# EAGLE design 12V10A supply (EAGLE 6.4)
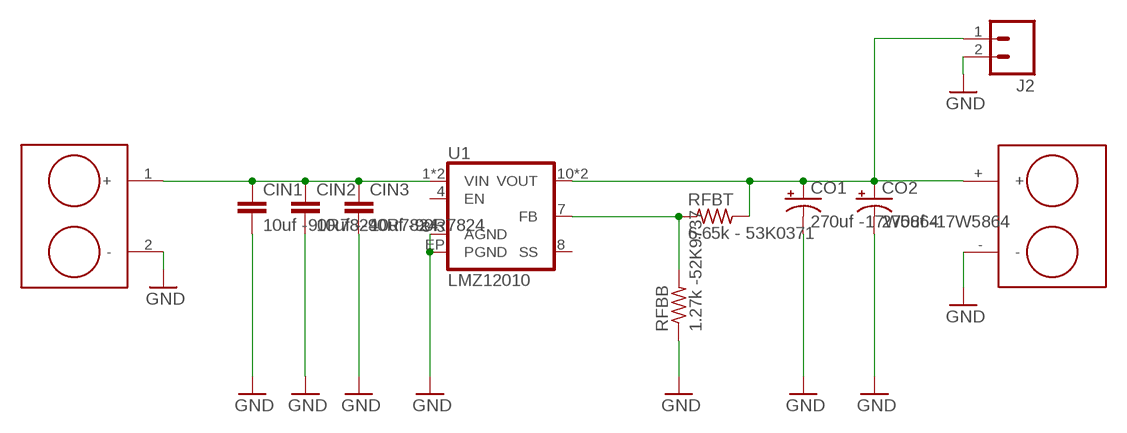
[diagram p0: schematic, sheet 1]

## Parts
CIN1  10uf -90R7824  C-EUC1210  [C1210]
CIN2  10uf --90R7824  C-EUC1210  [C1210]
CIN3  10uf -90R7824  C-EUC1210  [C1210]
CO1  270uf -17W5864  NPCAP-PXA-CAP  [JC0CAP]
CO2  270uf -17W5864  NPCAP-PXA-CAP  [JC0CAP]
J1  5569-02A2MS-225  [0050362375]
J2  M02PTH  [1X02]
J3  MC24356  [2PINTERMINAL]
RFBB  1.27k -52K9737  R-US_M0805  [M0805]
RFBT  6.65k - 53K0371  R-US_M0805  [M0805]
U1  LMZ12010  [TO-PMOD-11]

## Nets
GND: CIN1.2 CIN2.2 CIN3.2 CO1.- CO2.- J1.2(-) J2.2 J3.- RFBB.1 U1.3(AGND) U1.5(AGND) U1.6(AGND) U1.EP(PGND)
N$4: RFBB.2 RFBT.1 U1.7(FB)
VIN: CIN1.1 CIN2.1 CIN3.1 J1.1(+) U1.1(VIN) U1.2(VIN)
VOUT: CO1.+ CO2.+ J2.1 J3.+ RFBT.2 U1.10(VOUT) U1.11(VOUT)
Unconnected: U1.4(EN) U1.8(SS)

## Library data of the parts
CIN1-CIN3 = rcl:C-EU: CAPACITOR, European symbol
CO1 CO2 = Texas Instruments:NPCAP-PXA-CAP; MFG_PN: APXA160ARA331MJC0G; MOUSER_PN: 661-PXA16VC331M
J1 = Texas Instruments:5569
J2 = SparkFun-Connectors:M02: Header 2 Standard 2-pin 0.1" header. Use with straight break away headers (SKU : PRT-00116), right angle break away headers (PRT-00553), swiss pins (PRT-00743), machine pins (PRT-00117), and female headers (PRT-00115). Molex polarized connector foot print use with SKU : PRT-08233 with associated crimp pins and housings.
J3 = Texas Instruments:MC24356: MULTICOMP - MC24356 - TERMINAL BLOCK EUROSTYLE, 2POS, 26-12AWG
RFBB RFBT = adafruit:R-US_: RESISTOR, American symbol
U1 = Texas Instruments:LMZ12010: 3A, Simple Switcher Power Module with 42V Maximum Input

## Net classes
0 default: width 0.305 mm

## Board
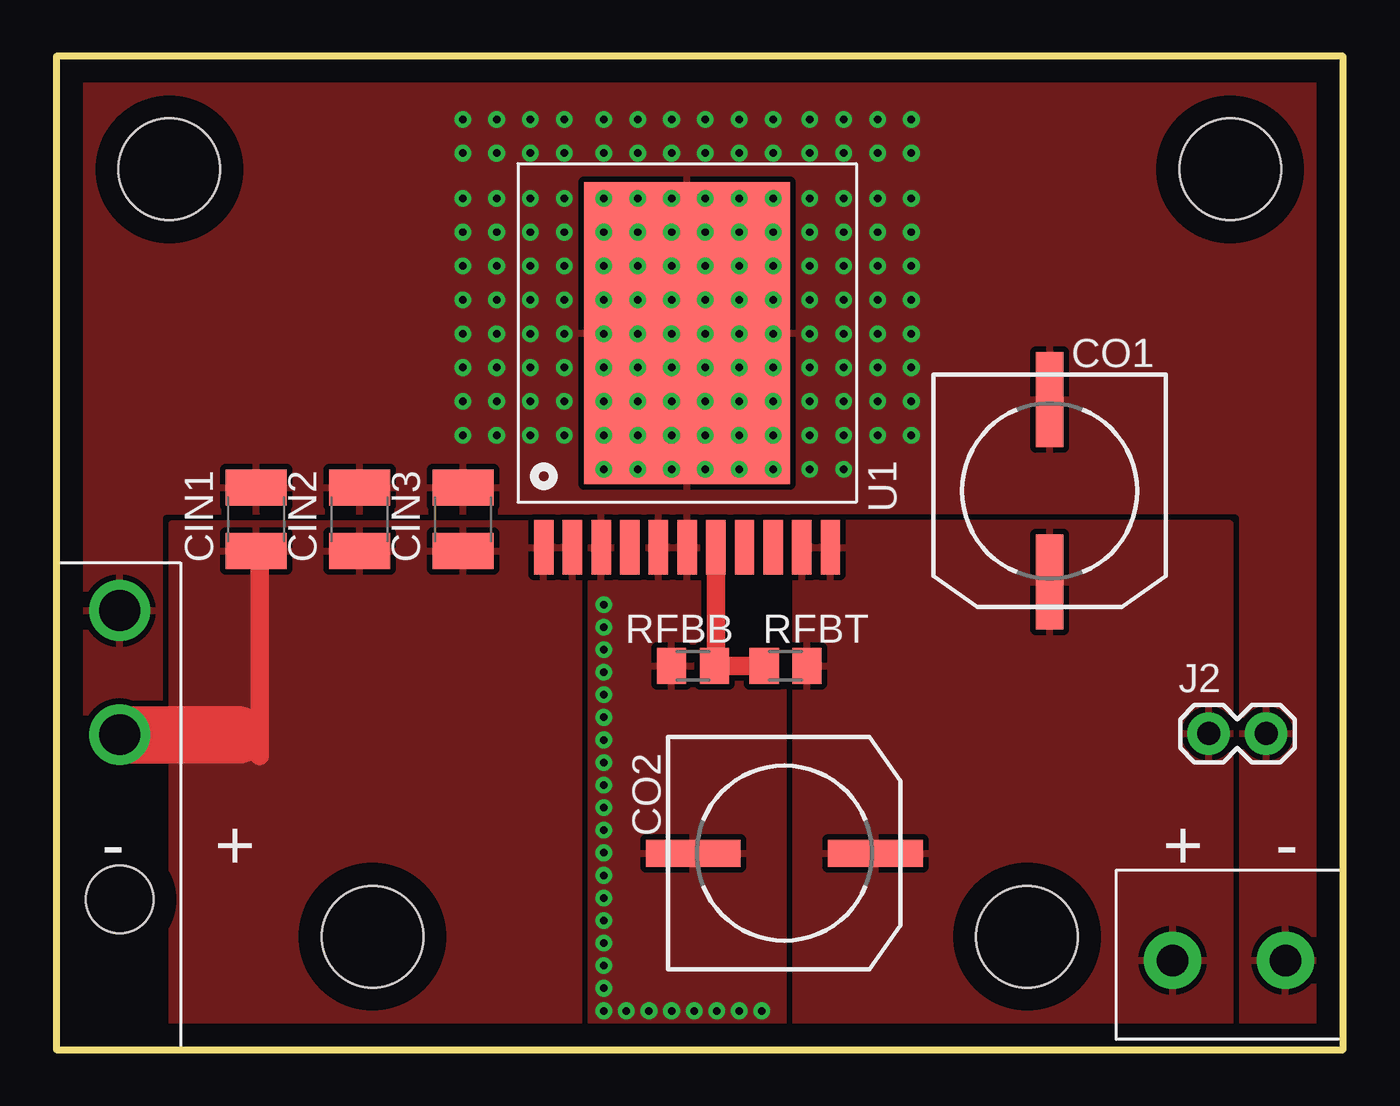
[diagram p1: board, top side]
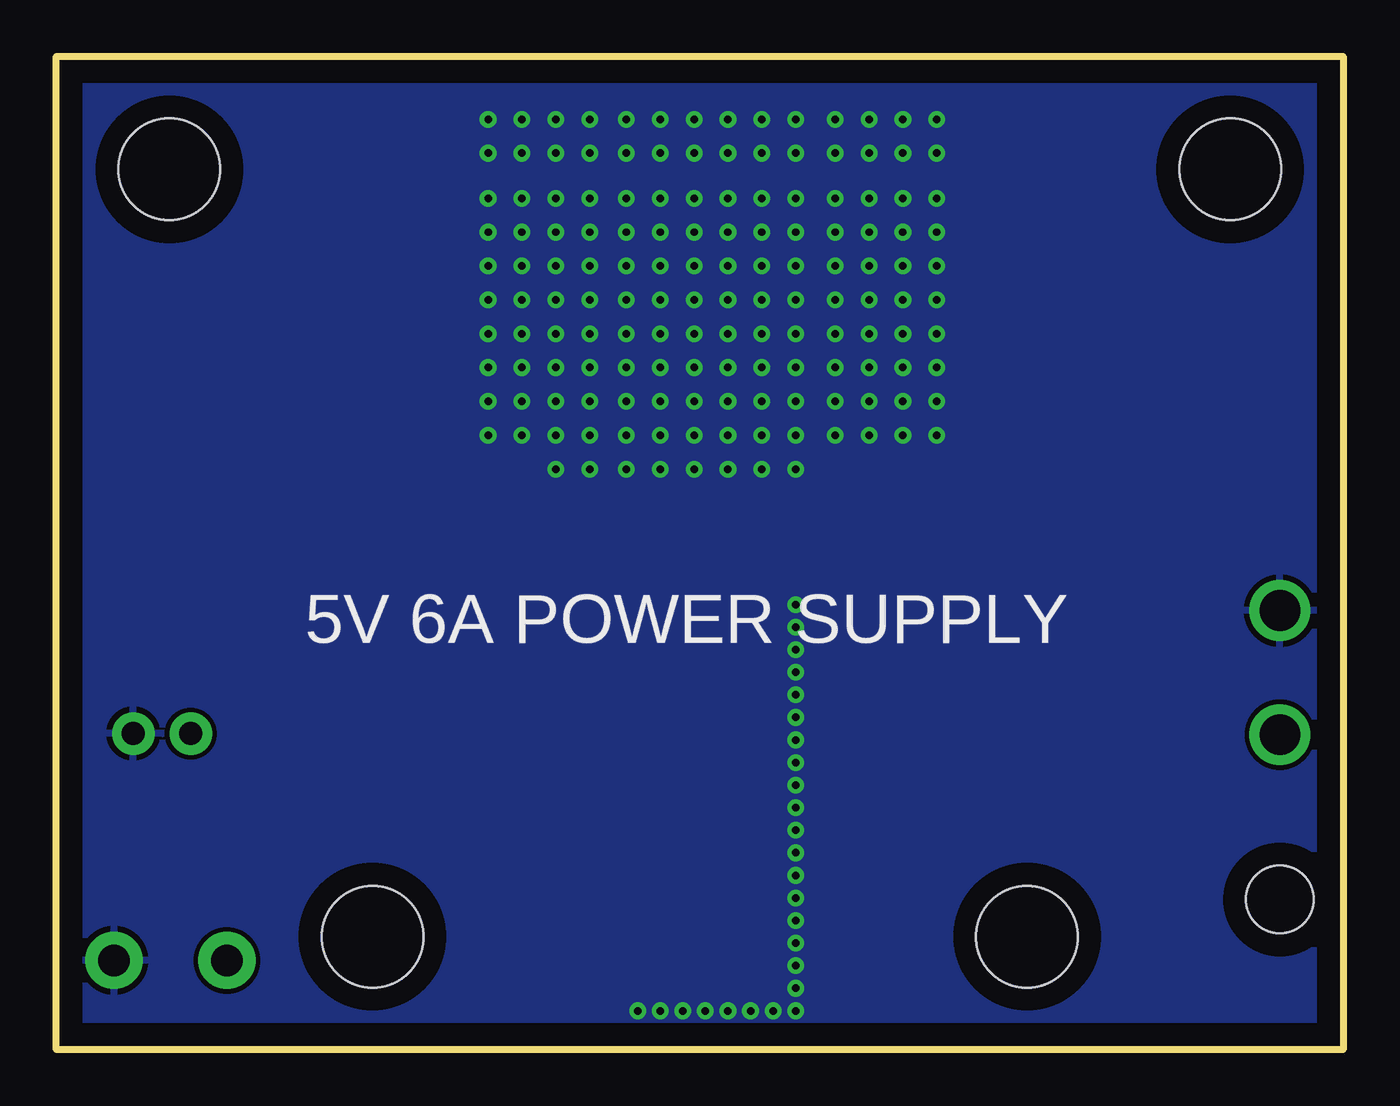
[diagram p2: board, bottom side, seen from below]

Size 57 x 44 mm. Coordinates in mm from the lower left corner, seen from the top.
Outline: 0,0 57,0 57,44 0,44 0,0
Copper layers (1*16): Top 0.035mm / dielectric 1.5mm / Bottom 0.035mm
Design rules "default *": minimum track width 9mil, minimum drill 13mil, track to track 8mil, track to pad 8mil, pad to pad 8mil, via to via 8mil, smd to smd 8mil, copper to edge 40mil, drill to drill 8mil, minimum pad ring 10mil, minimum via ring 8mil, stop-mask expansion 4mil, vias tented up to drill 0mil, thermal gap 10mil
Holes 4.5 mm at 5,39 52,39 43,5 14,5

### Footprints (pad centres in the part's own frame; a part is rotated, then mirrored left to right if it is on the bottom)
C1210 = smd 1.6 x 2.7: 1 -1.4,0; 2 1.4,0
JC0CAP = smd 4.2 x 1.2: + 4.04,0; - -4.04,0
0050362375 = drill 1.8: 1 0,0; 2 0,5.5 | hole 3: 0,-7.3
1X02 = drill 1.016 pad 1.88: 1 0,0; 2 2.54,0
2PINTERMINAL = drill 1.4 pad 2.54: + -0.25,2.5; - -0.25,-2.5
M0805 = smd 1.3 x 1.6: 1 -0.95,0; 2 0.95,0
TO-PMOD-11 = smd 0.86 x 2.41: 1 -6.35,-9.5; 2 -5.08,-9.5; 3 -3.81,-9.5; 4 -2.54,-9.5; 5 -1.27,-9.5; 6 0,-9.5; 7 1.27,-9.5; 8 2.54,-9.5; 9 3.81,-9.5; 10 5.08,-9.5; 11 6.35,-9.5 | smd 9.126 x 13.37: EP 0,0

### Placement (x,y rotation side)
CIN1  8.85,23.5 90 top
CIN2  13.43,23.5 90 top
CIN3  18.01,23.5 90 top
CO1  44,24.75 270 top
CO2  32.25,8.7 0 top
J1  2.8,13.95 0 top
J2  51.05,14 0 top
J3  51.95,4.2 90 top
RFBB  28.2,17 0 top
RFBT  32.3,17 0 top
U1  27.94,31.75 0 top

### Tracks (layer width: path | path; a pad name or v marks a point on that pad's centre or on a via)
GND  (via drill 0.33)
  other vias: 24.25,37.72 25.75,37.72 27.25,37.72 28.75,37.72 30.25,37.72 31.75,37.72 31.75,36.22 30.25,36.22 28.75,36.22 27.25,36.22 25.75,36.22 24.25,36.22 24.25,34.72 25.75,34.72 27.25,34.72 28.75,34.72 30.25,34.72 31.75,34.72 24.25,33.22 25.75,33.22 27.25,33.22 28.75,33.22 30.25,33.22 31.75,33.22 31.75,31.71 30.25,31.71 28.75,31.71 27.25,31.71 25.75,31.71 24.25,31.71 24.25,30.21 24.25,28.71 24.25,27.21 24.25,25.71 25.75,25.71 25.75,27.21 25.75,28.71 25.75,30.21 27.25,30.21 27.25,28.71 27.25,27.21 28.75,25.71 28.75,27.21 28.75,28.71 28.75,30.21 30.25,30.21 31.75,30.21 31.75,28.71 30.25,28.71 30.25,27.21 31.75,27.21 31.75,25.71 30.25,25.71 33.38,37.72 34.88,37.72 34.88,36.22 33.38,36.22 33.38,34.72 34.88,34.72 33.38,33.22 34.88,33.22 34.88,31.71 33.38,31.71 33.38,30.21 34.88,30.21 34.88,28.71 33.38,28.71 33.38,27.21 34.88,27.21 34.88,25.71 33.38,25.71 21,37.72 22.5,37.72 22.5,36.22 21,36.22 21,34.72 22.5,34.72 21,33.22 22.5,33.22 22.5,31.71 21,31.71 21,30.21 21,28.71 21,27.21 22.5,27.21 22.5,28.71 22.5,30.21 24.25,41.22 25.75,41.22 27.25,41.22 28.75,41.22 30.25,41.22 31.75,41.22 31.75,39.72 30.25,39.72 28.75,39.72 27.25,39.72 25.75,39.72 24.25,39.72 21,41.22 22.5,41.22 22.5,39.72 21,39.72 33.38,41.22 34.88,41.22 34.88,39.72 33.38,39.72 18,37.72 19.5,37.72 19.5,36.22 18,36.22 18,34.72 19.5,34.72 18,33.22 19.5,33.22 19.5,31.71 18,31.71 18,30.21 18,28.71 18,27.21 19.5,27.21 19.5,28.71 19.5,30.21 18,41.22 19.5,41.22 19.5,39.72 18,39.72 36.38,37.72 36.38,36.22 36.38,34.72 36.38,33.22 36.38,31.71 36.38,30.21 36.38,28.71 36.38,27.21 36.38,41.22 36.38,39.72 37.88,37.72 37.88,36.22 37.88,34.72 37.88,33.22 37.88,31.71 37.88,30.21 37.88,41.22 37.88,39.72 37.88,28.71 37.88,27.21 24.25,1.72 26.25,1.72 25.25,1.72 28.25,1.72 27.25,1.72 29.25,1.72 30.25,1.72 31.25,1.72 24.25,2.71 24.25,3.71 24.25,4.71 24.25,5.71 24.25,6.71 24.25,7.71 24.25,8.71 24.25,9.71 24.25,10.71 24.25,11.71 24.25,12.71 24.25,13.71 24.25,14.71 24.25,15.71 24.25,16.71 24.25,17.71 24.25,18.71 24.25,19.71 27.25,25.71
  pour Top (isolate 0.254, rank 2): 0,44 57,44 57,0 0,0
  pour Bottom: 0,44 57,44 57,0 0,0
N$4
  Top 0.813: U1.7 29.21,17.06 RFBB.2 RFBT.1
VIN
  Top 0.813: 8.05,13.95 9,13 9,21.95 CIN1.1
  Top 2.54: J1.1 8.05,13.95
  pour Top: 5.12,23.3 23.14,23.3 23.14,0 5.12,0
VOUT
  pour Top: 32.74,23.3 32.74,0 52,0 52,23.3

### Text on the board
tPlace: - | + | + | -
bPlace: 5V 6A POWER SUPPLY